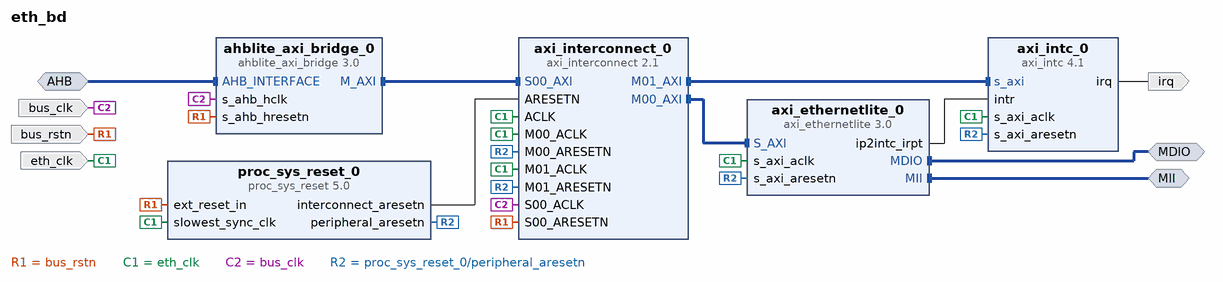
[diagram p0: block diagram of the top level]
# Vivado block design eth_bd, xc7k160tffg676-2, Vivado 2017.3
create_bd_design eth_bd

create_bd_intf_port -mode Slave -vlnv xilinx.com:interface:ahblite_rtl:2.0 AHB
create_bd_intf_port -mode Master -vlnv xilinx.com:interface:mii_rtl:1.0 MII
create_bd_intf_port -mode Master -vlnv xilinx.com:interface:mdio_rtl:1.0 MDIO
create_bd_port -dir I -type rst bus_rstn
create_bd_port -dir I -type clk eth_clk
set_property -dict {CONFIG.FREQ_HZ 100000000} [get_bd_ports eth_clk]
create_bd_port -dir I -type clk bus_clk
set_property -dict {CONFIG.FREQ_HZ 50000000} [get_bd_ports bus_clk]
create_bd_port -dir O -type intr irq

create_bd_cell -type ip -vlnv xilinx.com:ip:ahblite_axi_bridge:3.0 ahblite_axi_bridge_0
create_bd_cell -type ip -vlnv xilinx.com:ip:axi_ethernetlite:3.0 axi_ethernetlite_0
set_property -dict {CONFIG.C_S_AXI_PROTOCOL AXI4} [get_bd_cells axi_ethernetlite_0]
create_bd_cell -type ip -vlnv xilinx.com:ip:axi_interconnect:2.1 axi_interconnect_0
set_property -dict {CONFIG.NUM_MI 2 CONFIG.SYNCHRONIZATION_STAGES 2} [get_bd_cells axi_interconnect_0]
create_bd_cell -type ip -vlnv xilinx.com:ip:proc_sys_reset:5.0 proc_sys_reset_0
create_bd_cell -type ip -vlnv xilinx.com:ip:axi_intc:4.1 axi_intc_0
set_property -dict [list \
  CONFIG.C_HAS_ILR 1 \
  CONFIG.C_S_AXI_ACLK_FREQ_MHZ 100 \
  CONFIG.C_PROCESSOR_CLK_FREQ_MHZ 50 \
  CONFIG.C_IRQ_CONNECTION 1 \
] [get_bd_cells axi_intc_0]

# ---- connections ----

connect_bd_intf_net [get_bd_intf_pins axi_interconnect_0/M00_AXI] [get_bd_intf_pins axi_ethernetlite_0/S_AXI]
connect_bd_intf_net [get_bd_intf_pins axi_interconnect_0/S00_AXI] [get_bd_intf_pins ahblite_axi_bridge_0/M_AXI]
connect_bd_intf_net [get_bd_intf_pins axi_interconnect_0/M01_AXI] [get_bd_intf_pins axi_intc_0/s_axi]
connect_bd_intf_net [get_bd_intf_ports AHB] [get_bd_intf_pins ahblite_axi_bridge_0/AHB_INTERFACE]
connect_bd_intf_net [get_bd_intf_ports MII] [get_bd_intf_pins axi_ethernetlite_0/MII]
connect_bd_intf_net [get_bd_intf_ports MDIO] [get_bd_intf_pins axi_ethernetlite_0/MDIO]
connect_bd_net -net s_ahb_hresetn_1 [get_bd_ports bus_rstn] \
  [get_bd_pins ahblite_axi_bridge_0/s_ahb_hresetn] [get_bd_pins proc_sys_reset_0/ext_reset_in] \
  [get_bd_pins axi_interconnect_0/S00_ARESETN]
connect_bd_net [get_bd_ports eth_clk] \
  [get_bd_pins axi_ethernetlite_0/s_axi_aclk] [get_bd_pins proc_sys_reset_0/slowest_sync_clk] \
  [get_bd_pins axi_interconnect_0/ACLK] [get_bd_pins axi_interconnect_0/M00_ACLK] [get_bd_pins axi_intc_0/s_axi_aclk] \
  [get_bd_pins axi_interconnect_0/M01_ACLK]
connect_bd_net -net s_ahb_hclk_1 [get_bd_ports bus_clk] [get_bd_pins ahblite_axi_bridge_0/s_ahb_hclk] [get_bd_pins axi_interconnect_0/S00_ACLK]
connect_bd_net -net ARESETN_1 [get_bd_pins proc_sys_reset_0/interconnect_aresetn] [get_bd_pins axi_interconnect_0/ARESETN]
connect_bd_net -net M00_ARESETN_1 [get_bd_pins proc_sys_reset_0/peripheral_aresetn] \
  [get_bd_pins axi_ethernetlite_0/s_axi_aresetn] [get_bd_pins axi_interconnect_0/M00_ARESETN] \
  [get_bd_pins axi_intc_0/s_axi_aresetn] [get_bd_pins axi_interconnect_0/M01_ARESETN]
connect_bd_net [get_bd_pins axi_ethernetlite_0/ip2intc_irpt] [get_bd_pins axi_intc_0/intr]
connect_bd_net [get_bd_pins axi_intc_0/irq] [get_bd_ports irq]

# ---- address map ----
assign_bd_address -offset 0x00000000 -range 8K -target_address_space [get_bd_addr_spaces AHB] [get_bd_addr_segs axi_ethernetlite_0/S_AXI/Reg]
assign_bd_address -offset 0x00002000 -range 8K -target_address_space [get_bd_addr_spaces AHB] [get_bd_addr_segs axi_intc_0/S_AXI/Reg]

validate_bd_design
save_bd_design
